# EAGLE board stm32-d40-platform (EAGLE 6.5.0)
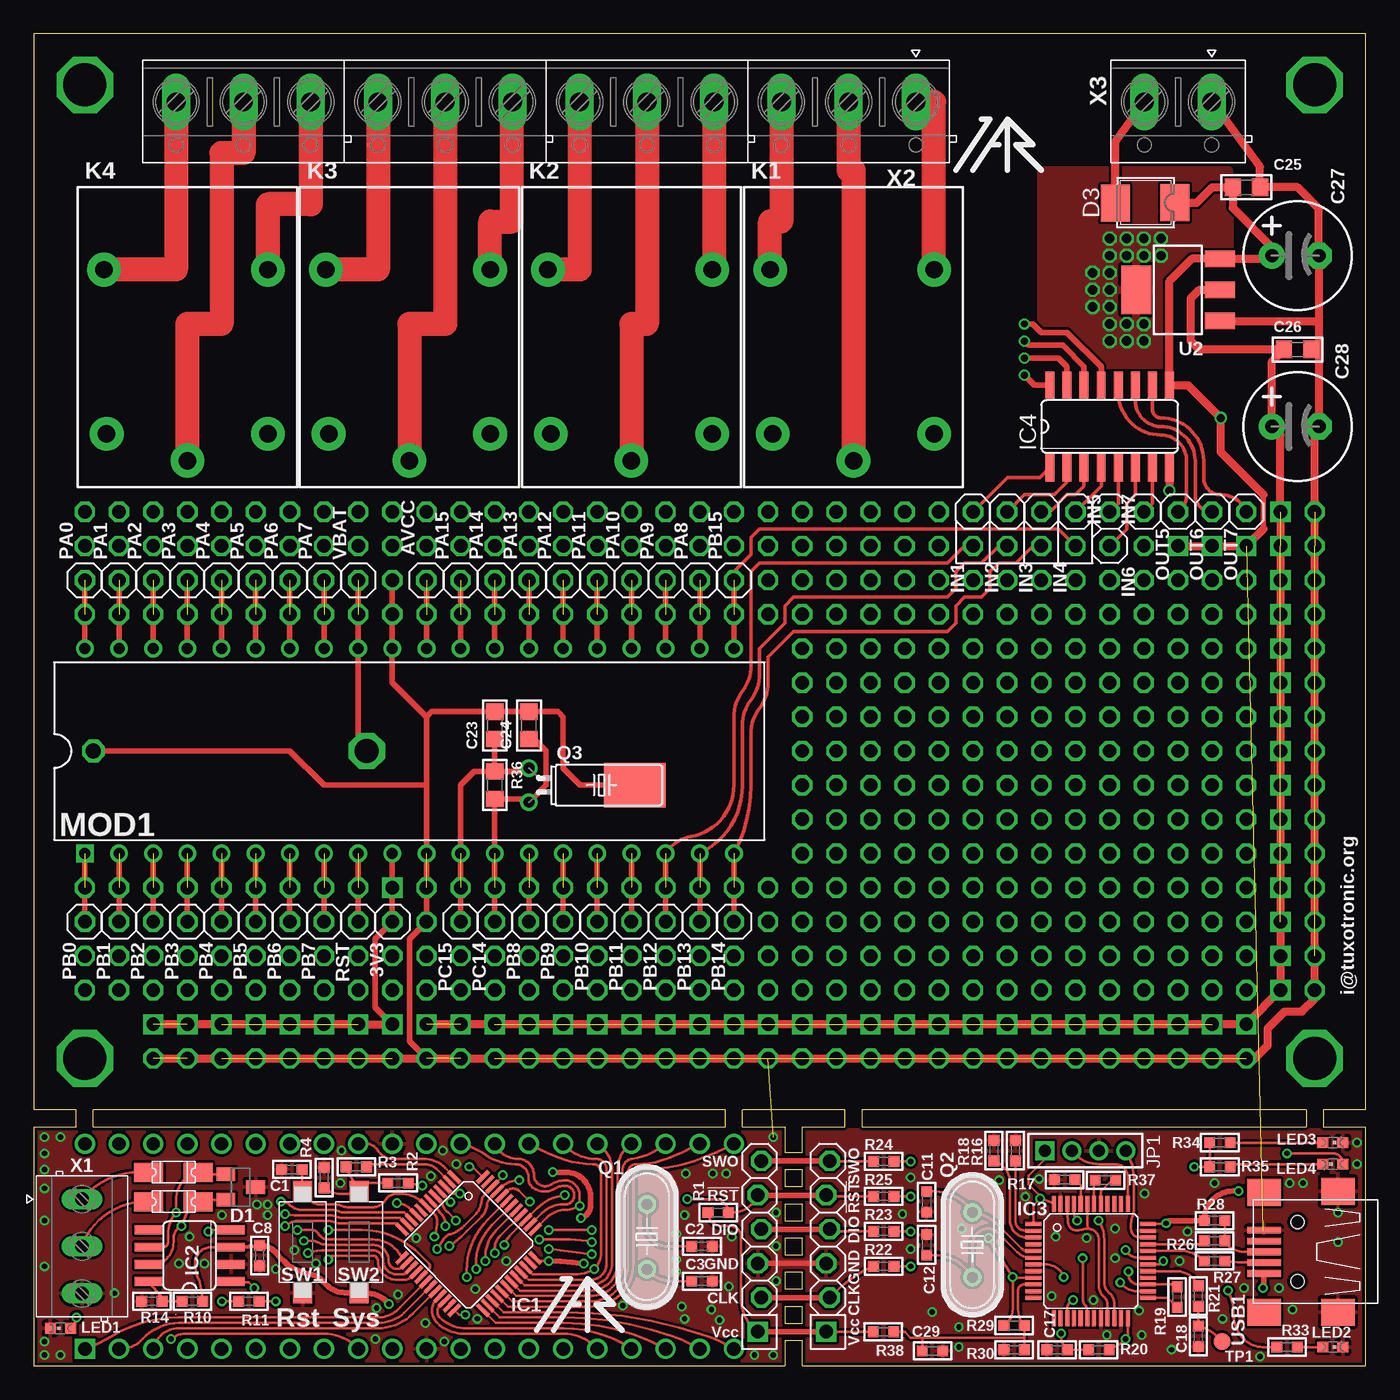
[diagram p3: board, top side]
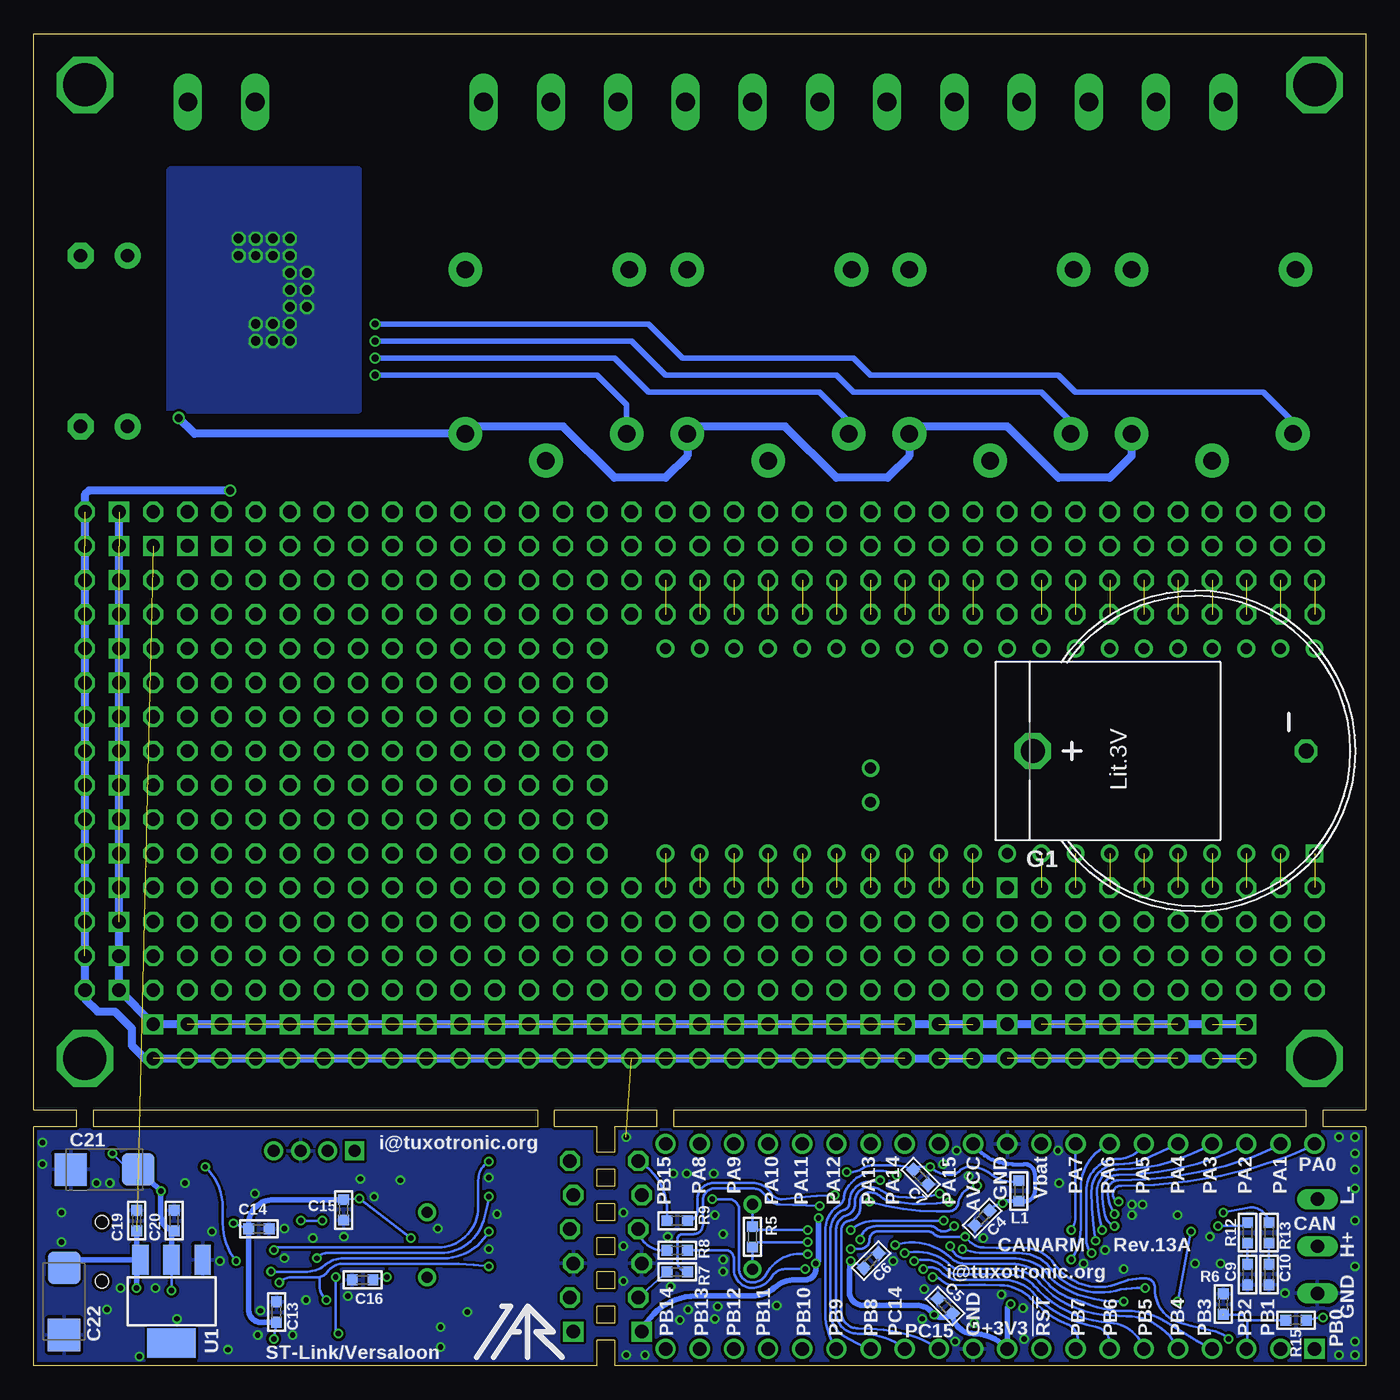
[diagram p4: board, bottom side, seen from below]

Size 99.06 x 99.06 mm. Coordinates in mm from the lower left corner, seen from the top.
Outline: 0,0 55.88,0 55.88,1.91 57.15,1.91 57.15,0 99.06,0 99.06,17.78 95.89,17.78 95.89,19.05 99.06,19.05 99.06,99.06 0,99.06 0,19.05 3.17,19.05 3.17,17.78 0,17.78 0,0
Outline: 4.45,17.78 51.44,17.78 51.44,19.05 4.45,19.05 4.45,17.78
Outline: 52.7,17.78 55.88,17.78 55.88,15.88 57.15,15.88 57.15,17.78 60.33,17.78 60.33,19.05 52.7,19.05 52.7,17.78
Outline: 55.88,14.61 55.88,13.34 57.15,13.34 57.15,14.61 55.88,14.61
Outline: 55.88,12.06 55.88,10.79 57.15,10.79 57.15,12.06 55.88,12.06
Outline: 55.88,9.53 55.88,8.26 57.15,8.26 57.15,9.53 55.88,9.53
Outline: 55.88,6.99 55.88,5.71 57.15,5.71 57.15,6.99 55.88,6.99
Outline: 55.88,4.45 55.88,3.17 57.15,3.17 57.15,4.45 55.88,4.45
Outline: 61.59,17.78 94.61,17.78 94.61,19.05 61.59,19.05 61.59,17.78
Copper layers (1*16): Top 0.035mm / dielectric 1.5mm / Bottom 0.035mm
Design rules "ITEADstudio_DRC": minimum track width 6mil, minimum drill 12mil, track to track 6mil, track to pad 6mil, pad to pad 6mil, via to via 6mil, smd to smd 0mil, copper to edge 10mil, drill to drill 10mil, minimum pad ring 10mil, minimum via ring 6mil, stop-mask expansion 2mil, vias tented up to drill 100mil, thermal gap 10mil

## Footprints (pad centres in the part's own frame; a part is rotated, then mirrored left to right if it is on the bottom)
1X01 = drill 1 octagon: 1 0,0
C0603 = smd 0.8 x 0.8: 1 -0.762,0; 2 0.762,0
SMC_C = smd 2.4 x 2.4: + -2.5,0; - 2.5,0
C0805 = smd 1.2 x 1.3: 1 -1.016,0; 2 1.016,0
CE-035X080 = drill 1 pad 1.93: + -1.905,0 | drill 1 pad 1.93 octagon: - 1.587,0
SOT23 = smd 1 x 1.4: 1 -0.95,-1.1; 2 0.95,-1.1; 3 0,1.1
SMB = smd 2.159 x 2.743: A 2.108,-0.102; C -2.311,-0.127
1206L = smd 2.16 x 1.4: P$1 -1.85,0; P$2 1.85,0
B2430 = drill 1.803 octagon: + 0,12.065 | drill 1.118 octagon: - 0,-8.255
LQFP48 = smd 0.3 x 1.2: 1 -2.75,-4.25; 2 -2.25,-4.25; 3 -1.75,-4.25; 4 -1.25,-4.25; 5 -0.75,-4.25; 6 -0.25,-4.25; 7 0.25,-4.25; 8 0.75,-4.25; 9 1.25,-4.25; 10 1.75,-4.25; 11 2.25,-4.25; 12 2.75,-4.25; 25 2.75,4.25; 26 2.25,4.25; 27 1.75,4.25; 28 1.25,4.25; 29 0.75,4.25; 30 0.25,4.25; 31 -0.25,4.25; 32 -0.75,4.25; 33 -1.25,4.25; 34 -1.75,4.25; 35 -2.25,4.25; 36 -2.75,4.25 | smd 1.2 x 0.3: 13 4.25,-2.75; 14 4.25,-2.25; 15 4.25,-1.75; 16 4.25,-1.25; 17 4.25,-0.75; 18 4.25,-0.25; 19 4.25,0.25; 20 4.25,0.75; 21 4.25,1.25; 22 4.25,1.75; 23 4.25,2.25; 24 4.25,2.75; 37 -4.25,2.75; 38 -4.25,2.25; 39 -4.25,1.75; 40 -4.25,1.25; 41 -4.25,0.75; 42 -4.25,0.25; 43 -4.25,-0.25; 44 -4.25,-0.75; 45 -4.25,-1.25; 46 -4.25,-1.75; 47 -4.25,-2.25; 48 -4.25,-2.75
SO08 = smd 0.66 x 2.032: 1 -1.905,-3.073; 2 -0.635,-3.073; 3 0.635,-3.073; 4 1.905,-3.073; 5 1.905,3.073; 6 0.635,3.073; 7 -0.635,3.073; 8 -1.905,3.073
SO16 = smd 0.66 x 2.032: 1 -4.445,-3.073; 2 -3.175,-3.073; 3 -1.905,-3.073; 4 -0.635,-3.073; 5 0.635,-3.073; 6 1.905,-3.073; 7 3.175,-3.073; 8 4.445,-3.073; 9 4.445,3.073; 10 3.175,3.073; 11 1.905,3.073; 12 0.635,3.073; 13 -0.635,3.073; 14 -1.905,3.073; 15 -3.175,3.073; 16 -4.445,3.073
DIP-40 = drill 1 square: 1 -24.13,-7.62 | drill 1: 2 -21.59,-7.62; 3 -19.05,-7.62; 4 -16.51,-7.62; 5 -13.97,-7.62; 6 -11.43,-7.62; 7 -8.89,-7.62; 8 -6.35,-7.62; 9 -3.81,-7.62; 10 -1.27,-7.62; 11 1.27,-7.62; 12 3.81,-7.62; 13 6.35,-7.62; 14 8.89,-7.62; 15 11.43,-7.62; 16 13.97,-7.62; 17 16.51,-7.62; 18 19.05,-7.62; 19 21.59,-7.62; 20 24.13,-7.62; 21 24.13,7.62; 22 21.59,7.62; 23 19.05,7.62; 24 16.51,7.62; 25 13.97,7.62; 26 11.43,7.62; 27 8.89,7.62; 28 6.35,7.62; 29 3.81,7.62; 30 1.27,7.62; 31 -1.27,7.62; 32 -3.81,7.62; 33 -6.35,7.62; 34 -8.89,7.62; 35 -11.43,7.62; 36 -13.97,7.62; 37 -16.51,7.62; 38 -19.05,7.62; 39 -21.59,7.62; 40 -24.13,7.62
1X04M = drill 0.9 square: 1 -3,0 | drill 0.9: 2 -1,0; 3 1,0; 4 3,0
ZN5 = drill 1.3 pad 2.5: 11 8.89,0; 12 -5.31,-6.2; 14 -5.31,6; A1 6.89,6; A2 6.89,-6
L0603 = smd 0.8 x 0.8: 1 -0.762,0; 2 0.762,0
CHIPLED_0603 = smd 0.8 x 0.8: A 0,-0.75; C 0,0.75
DIL40 = drill 0.813 square: 1 -24.13,-7.62 | drill 0.813: 2 -21.59,-7.62; 3 -19.05,-7.62; 4 -16.51,-7.62; 5 -13.97,-7.62; 6 -11.43,-7.62; 7 -8.89,-7.62; 8 -6.35,-7.62; 9 -3.81,-7.62; 10 -1.27,-7.62; 11 1.27,-7.62; 12 3.81,-7.62; 13 6.35,-7.62; 14 8.89,-7.62; 15 11.43,-7.62; 16 13.97,-7.62; 17 16.51,-7.62; 18 19.05,-7.62; 19 21.59,-7.62; 20 24.13,-7.62; 21 24.13,7.62; 22 21.59,7.62; 23 19.05,7.62; 24 16.51,7.62; 25 13.97,7.62; 26 11.43,7.62; 27 8.89,7.62; 28 6.35,7.62; 29 3.81,7.62; 30 1.27,7.62; 31 -1.27,7.62; 32 -3.81,7.62; 33 -6.35,7.62; 34 -8.89,7.62; 35 -11.43,7.62; 36 -13.97,7.62; 37 -16.51,7.62; 38 -19.05,7.62; 39 -21.59,7.62; 40 -24.13,7.62
HC49/S = drill 0.813: 1 -2.413,0; 2 2.413,0
TC38H-G = drill 0.8: 1 -1.27,0; 2 1.27,0 | smd 3.302 x 4.572: GND 0,7.874
R0603 = smd 0.8 x 0.8: 1 -0.762,0; 2 0.762,0
R0805 = smd 1.2 x 1.3: 1 -1.016,0; 2 1.016,0
KSS-2EG4430 = smd 1.6 x 1.4: 1 -3.75,0; 2 3.75,0
JTAG6PIN = drill 1 square: 1 -6.35,0.127 | drill 1 octagon: 2 -3.81,-0.127; 3 -1.27,0.127; 4 1.27,-0.127; 5 3.81,0.127; 6 6.35,-0.127
SWD6PIN_L = drill 1 square: 1 -6.35,0.127 | drill 1 octagon: 2 -3.81,-0.127; 3 -1.27,0.127; 4 1.27,-0.127; 5 3.81,0.127; 6 6.35,-0.127
B1,27 = smd 1.27 x 1.27: PP 0,0
SOT223 = smd 1.219 x 2.235: 1 -2.311,-3.099; 2 0,-3.099; 3 2.311,-3.099 | smd 3.6 x 2.2: 4 0,3.099
USB-MB-S2 = smd 2.5 x 0.5: D+ 2.5,0; D- 2.5,0.8; GND 2.5,-1.6; ID 2.5,-0.8; VBUS 2.5,1.6 | smd 2.5 x 2: GND@1 -3,4.5; GND@2 2.5,4.5; GND@3 -3,-4.5; GND@4 2.5,-4.4 | hole 1: 0,2.2; 0,-2.2
DG350-3.5-03P = drill 1 long: 1 -3.5,0; 2 0,0; 3 3.5,0
DG306-5.0-12P = drill 1.4 long: 1 -27.5,0; 2 -22.5,0; 3 -17.5,0; 4 -12.5,0; 5 -7.5,0; 6 -2.5,0; 7 2.5,0; 8 7.5,0; 9 12.5,0; 10 17.5,0; 11 22.5,0; 12 27.5,0
DG306-5.0-02P = drill 1.4 long: 1 -2.5,0; 2 2.5,0

## Placement (x,y rotation side)
3V3  [1X01]  26.67,33.02 270 top
AVCC  [1X01]  29.21,58.42 90 top
C1  0.1  [C0603]  19.2,14.6 180 top
C2  22pF  [C0603]  49.7,8.9 0 top
C3  22pF  [C0603]  49.7,6.3 0 top
C4  0.1  [C0603]  28.53,10.99 225 bottom
C5  0.1  [C0603]  31.27,4.45 135 bottom
C6  0.1  [C0603]  36.78,7.82 45 bottom
C7  0.1  [C0603]  33.11,14.04 315 bottom
C8  0.1  [C0603]  16.8,8.2 270 top
C9  560pF  [C0603]  8.8,6.8 270 bottom
C10  560pF  [C0603]  7.2,6.8 270 bottom
C11  20pF  [C0603]  66.4,12.2 270 top
C12  20pF  [C0603]  66.4,9 90 top
C13  0.1  [C0603]  81,4 90 bottom
C14  0.1  [C0603]  82.3,10.2 0 bottom
C15  0.1  [C0603]  76,11.6 270 bottom
C16  0.1  [C0603]  74.6,6.4 180 bottom
C17  0.1  [C0603]  76.1,1.2 180 top
C18  20pF  [C0603]  86.6,2.2 270 top
C19  0.1  [C0603]  91.4,10.8 90 bottom
C20  0.1  [C0603]  88.6,10.8 90 bottom
C21  100uF/6V3  [SMC_C]  93.8,14.6 180 bottom
C22  100uF/6V3  [SMC_C]  96.8,4.8 270 bottom
C23  22pF  [C0805]  34.29,47.62 90 top
C24  22pF  [C0805]  36.83,47.62 90 top
C25  0.1  [C0805]  90.17,87.63 0 top
C26  0.1  [C0805]  93.98,75.56 0 top
C27  100uF/6V3  [CE-035X080]  93.98,82.55 0 top
C28  100uF/6V3  [CE-035X080]  93.98,69.85 0 top
C29  0.01  [C0603]  66.83,1.11 0 top
D1  PESD1CAN  [SOT23]  15.4,13.3 270 top
D3  [SMB]  82.55,86.36 180 top
F1  0.2A  [1206L]  10.4,12.2 180 top
F2  0.2A  [1206L]  10.4,14.4 180 top
G1  B2430  [B2430]  12.7,45.72 90 bottom
IC1  STM32F103C8  [LQFP48]  32.34,9.09 225 top
IC2  TODO AMIS30663CANG2G  [SO08]  11.6,8.2 90 top
IC3  STM32F103C8  [LQFP48]  78.6,7.8 270 top
IC4  [SO16]  80.01,69.85 0 top
IN1  [1X01]  69.85,63.5 270 top
IN2  [1X01]  72.39,63.5 270 top
IN3  [1X01]  74.93,63.5 270 top
IN4  [1X01]  77.47,63.5 270 top
IN5  [1X01]  80.01,63.5 270 top
IN6  [1X01]  80.01,60.96 270 top
IN7  [1X01]  82.55,63.5 270 top
J1  DIP-40  [DIP-40]  27.94,8.89 0 top
JP1  [1X04M]  78.2,16 0 top
K1  ZNS5124  [ZN5]  60.96,76.2 270 top
K2  ZNS5124  [ZN5]  44.45,76.2 270 top
K3  ZNS5124  [ZN5]  27.94,76.2 270 top
K4  ZNS5124  [ZN5]  11.43,76.2 270 top
L1  bead  [L0603]  25.8,13.01 270 bottom
LED1  [CHIPLED_0603]  2,2.8 90 top
LED2  Red  [CHIPLED_0603]  96.6,1.4 270 top
LED3  Red  [CHIPLED_0603]  96.6,16.6 270 top
LED4  Green  [CHIPLED_0603]  96.6,15 90 top
MOD1  STM32-MOD-CAN  [DIL40]  27.94,45.72 0 top
OUT5  [1X01]  85.09,63.5 270 top
OUT6  [1X01]  87.63,63.5 270 top
OUT7  [1X01]  90.17,63.5 270 top
PA0  [1X01]  3.81,58.42 90 top
PA1  [1X01]  6.35,58.42 90 top
PA2  [1X01]  8.89,58.42 90 top
PA3  [1X01]  11.43,58.42 90 top
PA4  [1X01]  13.97,58.42 90 top
PA5  [1X01]  16.51,58.42 90 top
PA6  [1X01]  19.05,58.42 90 top
PA7  [1X01]  21.59,58.42 90 top
PA8  [1X01]  49.53,58.42 90 top
PA9  [1X01]  46.99,58.42 90 top
PA10  [1X01]  44.45,58.42 90 top
PA11  [1X01]  41.91,58.42 90 top
PA12  [1X01]  39.37,58.42 90 top
PA13  [1X01]  36.83,58.42 90 top
PA14  [1X01]  34.29,58.42 90 top
PA15  [1X01]  31.75,58.42 90 top
PB0  [1X01]  3.81,33.02 270 top
PB1  [1X01]  6.35,33.02 270 top
PB2  [1X01]  8.89,33.02 270 top
PB3  [1X01]  11.43,33.02 270 top
PB4  [1X01]  13.97,33.02 270 top
PB5  [1X01]  16.51,33.02 270 top
PB6  [1X01]  19.05,33.02 270 top
PB7  [1X01]  21.59,33.02 270 top
PB8  [1X01]  36.83,33.02 270 top
PB9  [1X01]  39.37,33.02 270 top
PB10  [1X01]  41.91,33.02 270 top
PB11  [1X01]  44.45,33.02 270 top
PB12  [1X01]  46.99,33.02 270 top
PB13  [1X01]  49.53,33.02 270 top
PB14  [1X01]  52.07,33.02 270 top
PB15  [1X01]  52.07,58.42 90 top
PC14  [1X01]  34.29,33.02 270 top
PC15  [1X01]  31.75,33.02 270 top
Q1  8MHz  [HC49/S]  45.6,9.6 270 top
Q2  8MHz  [HC49/S]  69.8,9 270 top
Q3  32768Hz  [TC38H-G]  36.83,43.18 270 top
R1  10K  [R0603]  50.9,11.4 180 top
R2  10K  [R0603]  27.1,13.6 0 top
R3  10K  [R0603]  24,14.8 0 top
R4  2.2K  [R0603]  21.6,14 270 top
R5  1M  [R0603]  45.6,9.6 270 bottom
R6  10K  [R0603]  10.6,4.6 90 bottom
R7  100  [R0603]  51.2,7 180 bottom
R8  100  [R0603]  51.2,8.6 180 bottom
R9  100  [R0603]  51.2,10.8 180 bottom
R10  0  [R0603]  11.8,4.8 180 top
R11  100  [R0603]  16,4.8 180 top
R12  100  [R0603]  8.8,9.9 90 bottom
R13  100  [R0603]  7.2,9.9 90 bottom
R14  NC  [R0603]  8.8,4.8 0 top
R15  330  [R0603]  5.2,3.4 0 bottom
R16  10K  [R0603]  73,16 270 top
R17  100K  [R0603]  76.66,13.85 0 top
R18  10K  [R0603]  71.4,16 270 top
R19  220  [R0603]  85.02,5.12 270 top
R20  100K  [R0603]  79.2,1.2 0 top
R21  100  [R0603]  86.6,5.2 270 top
R22  22  [R0603]  63.2,7.4 180 top
R23  22  [R0603]  63.2,10 180 top
R24  22  [R0603]  63.2,15.2 180 top
R25  22  [R0603]  63.2,12.6 180 top
R26  22  [R0603]  87.8,9.3 0 top
R27  22  [R0603]  87.8,7.8 0 top
R28  1.5K  [R0603]  87.8,10.8 180 top
R29  4.7K  [R0603]  72.9,3 180 top
R30  4.7K  [R0603]  72.9,1.2 0 top
R33  1K  [R0603]  93.2,1.4 0 top
R34  510  [R0603]  88.2,16.6 0 top
R35  510  [R0603]  88.2,14.8 0 top
R36  1M  [R0805]  34.29,43.18 270 top
R37  220  [R0603]  79.69,13.81 180 top
R38  4.7K  [R0603]  63.18,2.54 180 top
RST  [1X01]  24.13,33.02 270 top
S3.LOGO  LOGO  [TT_LOGO]  62.33,3.17 0 bottom
SW1  KSS-2EG4430  [KSS-2EG4430]  20,9.2 90 top
SW2  KSS-2EG4430  [KSS-2EG4430]  24.2,9.2 90 top
SWD1  SWD-6  [JTAG6PIN]  53.98,8.89 90 top
SWD2  SWD-6L  [SWD6PIN_L]  59.05,8.89 90 top
TP1  TPB1,27  [B1,27]  88.36,1.82 270 top
U1  [SOT223]  88.8,4.8 180 bottom
U2  [SOT223]  85.09,80.01 90 top
U$  LOGO  [TT_LOGO]  41.2,5.2 0 top
U$1  LOGO  [TT_LOGO]  72.39,91.44 0 top
USB1  USB-MB-S2  [USB-MB-S2]  93.98,8.49 180 top
VBAT  [1X01]  24.13,58.42 90 top
X1  DG3XX-03-3.5  [DG350-3.5-03P]  3.6,8.89 270 top
X2  DG3XX-12-5.0  [DG306-5.0-12P]  38.1,93.98 180 top
X3  DG3XX-02-5.0  [DG306-5.0-02P]  85.09,93.98 180 top

## Tracks (layer width: path | path; a pad name or v marks a point on that pad's centre or on a via)
!RESET  (via drill 0.4)
  Top 0.2: C1.1 SW1.2 arc68 21.4,12 22.4,12 arc-23 22.9,11.9 arc23 23.4,11.8 25.2,11.8 arc62 26.2,12.4 arc-53 27,12.8 27.28,12.8 arc-50 IC1.7 29.8,11.28 arc-46 30,10.8 arc-19 v29.8,9.6 | v38.3,8.7 v41.5,8.3 | v10.2,2 arc-37 11.4,2.4 21.6,2.4 arc-48 J1.9 | v48.6,12.4 50.66,12.4 arc-90 R1.1 51.95,11.4 arc69 SWD1.5 | R25.2 59.03,12.6 SWD2.5
  Top 0.406: SWD1.5 SWD2.5
  Bottom 0.2: v38.3,8.7 37.6,8.7 arc-90 36.9,9.4 arc90 36.3,10 32.6,10 arc44 32.1,9.8 arc-44 31.6,9.6 v29.8,9.6 29.4,9.2 arc-41 28.4,8.8 arc-2 25.6,8.8 arc56 23.2,7.6 arc-77 18.2,6.2 arc26 16.5,6.5 arc-6 16.4,6.5 arc96 15.7,5.8 15.7,5.7 arc-74 13.8,3.2 arc-3 11.4,2.6 arc32 v10.2,2 | v41.5,8.3 arc-72 44.6,6.8 arc62 45.6,6.2 arc90 46.6,7.2 46.6,11.6 arc-90 47.4,12.4 v48.6,12.4
!S2.RESET  (via drill 1)  (1 unrouted)
  Top 0.406: MOD1.9 RST.1
  other vias: 24.13,35.56
!S3.RESET  (via drill 0.4)
  Top 0.2: R20.1 C17.1 arc-51 76.4,2.16 v76.4,2.4 | IC3.7 75.25,7.55 arc-70 v76.6,6.6
  Bottom 0.2: v76.6,6.6 76.6,2.6 v76.4,2.4
+3V3  (via drill 0.4)
  Top 0.2: IC1.24 31.62,3.8 v32.1,3.8 | IC1.48 32.7,14.74 v32.4,14.8 | v38.3,7.8 37.52,7.8 IC1.36 | IC2.3 13.23,8.84 arc90 12,7.6 arc23 12.2,6.6 arc-22 R10.1 | SWD1.1 arc-54 52.6,4.99 52.6,9.6 arc90 51.8,10.4 51.14,10.4 arc-90 R1.2 | SWD2.1 R38.2
  Top 0.3: IC2.3 arc7 C8.1
  Top 0.406: v38.3,7.8 arc-9 v40.9,7.6 | v38.6,14.4 39.6,14.4 arc-90 41.4,12.6 41.4,11.9 arc-76 v40.7,11 | C8.1 arc-56 18.1,8.3 arc41 20.6,6.8 arc-41 21.6,6.2 arc52 23.15,5.45 SW2.1 24.25,5.4 24.8,5.4 arc-53 v26.4,4.6 | SWD1.1 SWD2.1
  Bottom 0.2: C6.1 38.24,7.8 v38.3,7.8 | C5.1 30.84,3.8 | v38.6,14.4 38.4,14.4 arc-33 37.4,14.7 arc30 36.8,14.9 arc7 34.9,14.9 arc22 C7.1 33.42,14.8 v32.4,14.8 arc-44 30.9,14.2 arc-46 30.2,14.5 arc46 29.5,14.8 arc39 27.8,14.2 arc-54 L1.1
  Bottom 0.4: 30.84,3.8 arc71 v32.1,3.8
  Bottom 0.406: v38.3,7.8 arc-10 38.4,6.7 38.4,5.5 arc-90 37.4,4.5 33.4,4.5 arc57 v32.1,3.8 | v40.7,11 40.7,7.8 v40.9,7.6 arc15 40.9,7.1 arc82 41.7,6.4 42.4,6.4 arc-41 44,5.8 arc41 45.6,5.2 49.79,5.2 arc-66 SWD1.1 | C5.1 arc-89 29.2,2.4 arc48 J1.10 26.67,4.33 v26.4,4.6
+5V  (via drill 0.4, 0.6, 1)  (1 unrouted)
  Top 0.406: USB1.VBUS 91.48,5.88 v91.4,5.8 | 91.44,62.23 91.44,64.77
  Top 0.61: D3.C 86.49,86.49 87.63,87.63 C25.1 89.15,86.11 92.08,83.19 C27.+ 91.85,82.32 U2.3 86.13,82.32 84.45,80.64 IC4.9 85.83,72.92 v88.27,70.48 88.27,67.94 91.44,64.77 | v85.09,60.96 v87.63,60.96 v90.17,60.96 91.44,62.23
  Bottom 0.406: C19.1 91.4,8.19 U1.3 | U1.3 96.2,7.9 C22.+ | v91.4,5.8 91.4,7.61 U1.3
  Bottom 0.61: K4.A1 17.43,67.66 19.05,66.04 22.86,66.04 26.67,69.85 33.4,69.85 K3.A1 33.94,67.66 35.56,66.04 39.37,66.04 43.18,69.85 49.91,69.85 K2.A1 50.45,67.66 52.07,66.04 55.88,66.04 59.69,69.85 66.42,69.85 K1.A1 87.09,69.31 v88.27,70.48
AVCC  (via drill 0.4)
  Top 0.2: IC1.9 27.96,11.7 arc45 v27,12.1
  Bottom 0.2: C4.1 27.82,11.7 arc38 v27,12.1
  Bottom 0.3: v27,12.1 26.85,12.25 L1.2 25.35,12.25 arc-90 24.6,13 24.6,14.2 arc-90 25.4,15 26.3,15 arc55 J1.30
BOOT0  (via drill 0.4)
  Top 0.2: v28.9,13.4 R2.2 | v36.9,12.2 36.1,13 arc90 35.19,13 IC1.44
  Bottom 0.2: v28.9,13.4 arc-69 30.3,12.2 arc90 31,11.5 31.9,11.5 arc16 v36.9,12.2
CAN_CTRL
  Top 0.2: IC2.8 9.56,5.06 R14.2 R10.2
CAN_H
  Top 0.2: F1.P$2 8.31,12.2 arc70 X1.2
CAN_L
  Top 0.2: F2.P$2 7.8,14.4 arc51 X1.1
GND  (via drill 0.4, 0.6, 1)  (44 unrouted)
  Top 0.406: SWD2.3 SWD1.3 | 29.21,43.18 MOD1.11 v29.21,33.02 27.94,31.75 27.94,24.13 v29.21,22.86 | 43.18,43.18 Q3.GND 40.64,43.18 39.37,44.45 39.37,48.26 38.99,48.64 C24.2 C23.2 29.59,48.64 29.21,48.26 | 29.21,43.18 21.59,43.18 19.05,45.72 G1.- | 29.21,48.26 26.67,50.8 MOD1.31 v26.67,55.88 v26.67,58.42 | 29.21,43.18 29.21,48.26
  Top 0.61: v8.89,22.86 v26.67,22.86 v29.21,22.86 v90.17,22.86 90.81,22.86 91.76,23.81 91.76,25.08 93.03,26.35 94.3,26.35 95.25,27.3 v95.25,27.94 v95.25,63.5 95.25,69.53 C28.- 95.57,75.56 | 95.57,77.47 C27.- 95.57,86.04 93.98,87.63 C25.2 91.19,89.15 87.63,93.98 X3.1 | 95.57,77.47 95.57,75.56 | U2.1 95.34,77.7 95.57,77.47 | C26.2 95.57,75.56 | IC4.8 v84.45,65.09
  Bottom 0.61: v8.89,22.86 v90.17,22.86 90.81,22.86 91.76,23.81 91.76,25.08 93.03,26.35 94.3,26.35 95.25,27.3 v95.25,27.94 v95.25,63.5 95.25,64.77 94.93,65.09 v84.45,65.09
  other vias: 28.44,9.5 32.84,5.7 35.14,7.8 22.8,13.6 30.44,16 12.7,7.6 48.5,14.3 48.4,11.2 51.7,5.9 43.8,4.5 17.4,12 17.4,11.2 16.6,12 11.6,9.6 6,5.4 29.14,3.2 30.54,1.8 48.2,4.4 48.4,3.5 50.4,4.2 47.8,7 47.8,7.9 47.8,9.8 50.5,14.3 51.5,14.3 31.44,15 29.54,14.1 22.9,16 19.4,8.6 18,7.2 33,3.5 25.5,4.3 27.1,5.3 25.4,2 51.9,9.6 55.2,11.4 55.2,8.9 55.2,6.3 53.6,0.8 51,3.4 0.8,0.8 2,0.8 0.8,17 2,17 0.8,15.8 21,7.6 55,0.8 55,17 14,11.2 10.8,7.6 0.8,14.6 0.8,13.2 0.8,10.8 0.8,7.4 0.8,1.8 76,9.6 80.4,10.2 88.4,3.5 75.7,5.2 82.2,4.1 79.8,2.3 84.6,1.2 93.6,4.2 92.6,5.8 90,5.8 73.74,12.57 82.6,12.8 98.4,16.6 87.8,13.6 93.4,13.6 97,11.4 97,9.2 91.2,0.7 78.3,9.5 80.4,8 85.2,7.8 78.8,4.9 69,10.2 82.4,2.3 68.8,1.4 68.8,2.9 66.8,4 65.2,8.7 64.6,11.3 65.2,14 74.76,13.91 71.8,13.8 85.8,10 98.4,15 94.4,13.6 11.43,22.86 13.97,22.86 16.51,22.86 19.05,22.86 21.59,22.86 24.13,22.86 31.75,22.86 34.29,22.86 36.83,22.86 39.37,22.86 41.91,22.86 44.45,22.86 46.99,22.86 49.53,22.86 52.07,22.86 54.61,22.86 57.15,22.86 59.69,22.86 62.23,22.86 64.77,22.86 67.31,22.86 69.85,22.86 72.39,22.86 74.93,22.86 77.47,22.86 80.01,22.86 82.55,22.86 85.09,22.86 87.63,22.86 95.25,30.48 95.25,33.02 95.25,35.56 95.25,38.1 95.25,40.64 95.25,43.18 95.25,45.72 95.25,48.26 95.25,50.8 95.25,53.34 95.25,55.88 95.25,58.42 95.25,60.96 29.21,35.56
  pour Top (isolate 0.203): -0.64,17.58 99.69,17.58 99.69,-0.64 -0.64,-0.64
  pour Bottom (isolate 0.203): -1.27,17.58 100.33,17.58 100.33,-1.27 -1.27,-1.27
HEAT  (via drill 0.7)
  other vias: 80.01,80.01 80.01,78.74 81.28,77.47 82.55,77.47 80.01,81.28 81.28,83.82 80.01,83.82 81.28,82.55 82.55,82.55 80.01,82.55 83.82,83.82 83.82,82.55 82.55,83.82 80.01,77.47 82.55,76.2 81.28,76.2 80.01,76.2 78.74,81.28 78.74,80.01 78.74,78.74
  pour Top (isolate 0.203): 88.9,88.9 88.9,71.12 74.93,71.12 74.93,88.9
  pour Bottom (isolate 0.203): 88.9,88.9 88.9,71.12 74.93,71.12 74.93,88.9
MCO
  Top 0.2: TP1.PP 88.02,2.16 arc31 C18.1 R21.2
N$1
  Top 0.2: R3.1 23.24,14.71 SW2.2 | R2.1 24.65,13.6 SW2.2 | SW2.2 24.45,12.8 22.8,12.8 arc-40 R4.2
N$2
  Top 0.2: IC3.44 77.85,13.42 R17.2
N$3
  Top 0.2: IC3.3 73.85,9.55 arc-90 72.6,10.8 72.6,13.6 arc72 R18.2
N$4
  Top 0.2: IC3.2 73.75,10.05 arc-90 73,10.8 R16.2
N$5  (via drill 0.4)
  Top 0.2: v3.2,3.6 3,3.05 LED1.A
  Bottom 0.2: R15.2 3.4,3.6 v3.2,3.6
N$6  (via drill 1)
  other vias: 26.67,27.94
N$7  (via drill 0.4)
  Top 0.2: R11.2 v14,4.8 | v13,10 13.11,10.11 IC2.4
  Bottom 0.2: v14,4.8 v13,10
N$8  (via drill 1)
  other vias: 8.89,27.94
N$9  (via drill 1)
  other vias: 8.89,30.48
N$10  (via drill 1)
  other vias: 26.67,30.48
N$11
  Top 0.61: D3.A 80.44,91.05 X3.2
N$12  (via drill 1)
  other vias: 87.63,27.94
N$13  (via drill 1)
  other vias: 90.17,27.94
N$14  (via drill 1)
  other vias: 87.63,30.48
N$15  (via drill 1)
  other vias: 90.17,30.48
N$45
  Top 0.2: IC3.29 84.91,7.05 arc-66 R21.1
N$46  (via drill 3.2)
  other vias: 3.81,22.86
N$47
  Top 0.2: USB1.D+ 89.94,8.49 arc-61 R26.2 R28.1
N$48
  Top 0.2: USB1.D- 90.02,7.69 arc-9 R27.2
N$50
  Top 0.2: R33.2 LED2.A
N$51  (via drill 0.4)
  Top 0.2: D1.2 12.4,12.35 F1.P$1 11.7,12.2 v11,10.4 arc67 10.4,9.4 10.4,9.2 arc-65 9.37,7.57 IC2.7
  Bottom 0.2: v11,10.4 8.94,10.4 R12.2
N$52  (via drill 0.4)
  Top 0.2: D1.1 12.4,14.25 F2.P$1 | IC2.6 9.63,8.84 arc90 10,9.2 10,9.8 arc-41 v10.6,11.4 10.6,12.4 arc-79 F2.P$1 | 12,14.4 F2.P$1
  Bottom 0.2: v10.6,11.4 8.6,11.8 arc78 R13.2
N$53
  Top 0.2: LED4.C 89.16,15 R35.2
N$54
  Bottom 0.2: C10.1 R13.1
N$55
  Bottom 0.2: C9.1 R12.1
N$56
  Top 0.2: R34.2 LED3.A
N$57  (via drill 3.2)
  other vias: 95.25,22.86
N$58  (via drill 3.2)
  other vias: 3.81,95.25
N$59  (via drill 3.2)
  other vias: 95.25,95.25
N$60  (via drill 1)
  other vias: 6.35,27.94
N$61  (via drill 1)
  other vias: 6.35,30.48
N$62  (via drill 1)
  other vias: 3.81,27.94
N$63  (via drill 1)
  other vias: 3.81,30.48
N$64
  Top 1.778: K1.14 66.96,93.98 X2.1
N$65
  Top 1.778: X2.2 60.6,88.9 60.96,88.9 K1.11
N$66
  Top 1.778: X2.3 55.6,85.09 54.76,85.09 K1.12
N$67
  Top 1.778: X2.4 50.6,81.51 K2.14
N$68
  Top 1.778: X2.5 45.6,77.47 44.45,77.47 K2.11
N$69
  Top 1.778: X2.6 40.6,81.51 K2.12
N$70
  Top 1.778: K3.14 33.94,85.09 35.56,85.09 35.56,93.98 X2.7
N$71
  Top 1.778: X2.8 30.6,77.47 27.94,77.47 K3.11
N$72
  Top 1.778: X2.9 25.6,81.51 K3.12
N$73
  Top 1.778: X2.10 20.6,86.36 17.43,86.36 K4.14
N$74
  Top 1.778: X2.11 15.6,90.17 13.97,90.17 13.97,77.47 11.43,77.47 K4.11
N$75
  Top 1.778: X2.12 10.6,81.51 K4.12
N$114  (via drill 1)
  other vias: 11.43,27.94
N$115  (via drill 1)
  other vias: 13.97,27.94
N$116  (via drill 1)
  other vias: 16.51,27.94
N$117  (via drill 1)
  other vias: 19.05,27.94
N$118  (via drill 1)
  other vias: 21.59,27.94
N$119  (via drill 1)
  other vias: 24.13,27.94
N$121  (via drill 1)
  other vias: 29.21,27.94
N$122  (via drill 1)
  other vias: 31.75,27.94
N$123  (via drill 1)
  other vias: 34.29,27.94
N$124  (via drill 1)
  other vias: 36.83,27.94
N$125  (via drill 1)
  other vias: 39.37,27.94
N$126  (via drill 1)
  other vias: 41.91,27.94
N$127  (via drill 1)
  other vias: 44.45,27.94
N$128  (via drill 1)
  other vias: 46.99,27.94
N$129  (via drill 1)
  other vias: 49.53,27.94
N$130  (via drill 1)
  other vias: 52.07,27.94
N$131  (via drill 1)
  other vias: 54.61,27.94
N$132  (via drill 1)
  other vias: 57.15,27.94
N$133  (via drill 1)
  other vias: 59.69,27.94
N$134  (via drill 1)
  other vias: 62.23,27.94
N$135  (via drill 1)
  other vias: 64.77,27.94
N$136  (via drill 1)
  other vias: 67.31,27.94
N$137  (via drill 1)
  other vias: 69.85,27.94
N$138  (via drill 1)
  other vias: 72.39,27.94
N$139  (via drill 1)
  other vias: 74.93,27.94
N$140  (via drill 1)
  other vias: 77.47,27.94
N$141  (via drill 1)
  other vias: 80.01,27.94
N$142  (via drill 1)
  other vias: 82.55,27.94
N$143  (via drill 1)
  other vias: 85.09,27.94
N$144  (via drill 1)
  other vias: 11.43,30.48
N$145  (via drill 1)
  other vias: 13.97,30.48
N$146  (via drill 1)
  other vias: 16.51,30.48
N$147  (via drill 1)
  other vias: 19.05,30.48
N$148  (via drill 1)
  other vias: 21.59,30.48
N$149  (via drill 1)
  other vias: 24.13,30.48
N$151  (via drill 1)
  other vias: 29.21,30.48
N$152  (via drill 1)
  other vias: 31.75,30.48
N$153  (via drill 1)
  other vias: 34.29,30.48
N$154  (via drill 1)
  other vias: 36.83,30.48
N$155  (via drill 1)
  other vias: 39.37,30.48
N$156  (via drill 1)
  other vias: 41.91,30.48
N$157  (via drill 1)
  other vias: 44.45,30.48
N$158  (via drill 1)
  other vias: 46.99,30.48
N$159  (via drill 1)
  other vias: 49.53,30.48
N$160  (via drill 1)
  other vias: 52.07,30.48
N$161  (via drill 1)
  other vias: 54.61,30.48
N$162  (via drill 1)
  other vias: 57.15,30.48
N$163  (via drill 1)
  other vias: 59.69,30.48
N$164  (via drill 1)
  other vias: 62.23,30.48
N$165  (via drill 1)
  other vias: 64.77,30.48
N$166  (via drill 1)
  other vias: 67.31,30.48
N$167  (via drill 1)
  other vias: 69.85,30.48
N$168  (via drill 1)
  other vias: 72.39,30.48
N$169  (via drill 1)
  other vias: 74.93,30.48
N$170  (via drill 1)
  other vias: 77.47,30.48
N$171  (via drill 1)
  other vias: 80.01,30.48
N$172  (via drill 1)
  other vias: 82.55,30.48
N$173  (via drill 1)
  other vias: 85.09,30.48
N$174  (via drill 1)
  other vias: 57.15,33.02
N$175  (via drill 1)
  other vias: 59.69,33.02
N$176  (via drill 1)
  other vias: 62.23,33.02
N$177  (via drill 1)
  other vias: 64.77,33.02
N$178  (via drill 1)
  other vias: 67.31,33.02
N$179  (via drill 1)
  other vias: 69.85,33.02
N$180  (via drill 1)
  other vias: 72.39,33.02
N$181  (via drill 1)
  other vias: 74.93,33.02
N$182  (via drill 1)
  other vias: 77.47,33.02
N$183  (via drill 1)
  other vias: 80.01,33.02
N$184  (via drill 1)
  other vias: 82.55,33.02
N$185  (via drill 1)
  other vias: 85.09,33.02
N$186  (via drill 1)
  other vias: 87.63,33.02
N$187  (via drill 1)
  other vias: 90.17,33.02
N$194  (via drill 1)
  other vias: 57.15,35.56
N$195  (via drill 1)
  other vias: 59.69,35.56
N$196  (via drill 1)
  other vias: 62.23,35.56
N$197  (via drill 1)
  other vias: 64.77,35.56
N$198  (via drill 1)
  other vias: 67.31,35.56
N$199  (via drill 1)
  other vias: 69.85,35.56
N$200  (via drill 1)
  other vias: 72.39,35.56
N$201  (via drill 1)
  other vias: 74.93,35.56
N$202  (via drill 1)
  other vias: 77.47,35.56
N$203  (via drill 1)
  other vias: 80.01,35.56
N$204  (via drill 1)
  other vias: 82.55,35.56
N$205  (via drill 1)
  other vias: 85.09,35.56
N$206  (via drill 1)
  other vias: 87.63,35.56
N$207  (via drill 1)
  other vias: 90.17,35.56
N$208  (via drill 1)
  other vias: 57.15,38.1
N$209  (via drill 1)
  other vias: 59.69,38.1
N$210  (via drill 1)
  other vias: 62.23,38.1
N$211  (via drill 1)
  other vias: 64.77,38.1
N$212  (via drill 1)
  other vias: 67.31,38.1
N$213  (via drill 1)
  other vias: 69.85,38.1
N$214  (via drill 1)
  other vias: 72.39,38.1
N$215  (via drill 1)
  other vias: 74.93,38.1
N$216  (via drill 1)
  other vias: 77.47,38.1
N$217  (via drill 1)
  other vias: 80.01,38.1
N$218  (via drill 1)
  other vias: 82.55,38.1
N$219  (via drill 1)
  other vias: 85.09,38.1
N$220  (via drill 1)
  other vias: 87.63,38.1
N$221  (via drill 1)
  other vias: 90.17,38.1
N$222  (via drill 1)
  other vias: 57.15,40.64
N$223  (via drill 1)
  other vias: 59.69,40.64
N$224  (via drill 1)
  other vias: 62.23,40.64
N$225  (via drill 1)
  other vias: 64.77,40.64
N$226  (via drill 1)
  other vias: 67.31,40.64
N$227  (via drill 1)
  other vias: 69.85,40.64
N$228  (via drill 1)
  other vias: 72.39,40.64
N$229  (via drill 1)
  other vias: 74.93,40.64
N$230  (via drill 1)
  other vias: 77.47,40.64
N$231  (via drill 1)
  other vias: 80.01,40.64
N$232  (via drill 1)
  other vias: 82.55,40.64
N$233  (via drill 1)
  other vias: 85.09,40.64
N$234  (via drill 1)
  other vias: 87.63,40.64
N$235  (via drill 1)
  other vias: 90.17,40.64
N$242  (via drill 1)
  other vias: 57.15,43.18
N$243  (via drill 1)
  other vias: 59.69,43.18
N$244  (via drill 1)
  other vias: 62.23,43.18
N$245  (via drill 1)
  other vias: 64.77,43.18
N$246  (via drill 1)
  other vias: 67.31,43.18
N$247  (via drill 1)
  other vias: 69.85,43.18
N$248  (via drill 1)
  other vias: 72.39,43.18
N$249  (via drill 1)
  other vias: 74.93,43.18
N$250  (via drill 1)
  other vias: 77.47,43.18
N$251  (via drill 1)
  other vias: 80.01,43.18
N$252  (via drill 1)
  other vias: 82.55,43.18
N$253  (via drill 1)
  other vias: 85.09,43.18
N$254  (via drill 1)
  other vias: 87.63,43.18
N$255  (via drill 1)
  other vias: 90.17,43.18
N$256  (via drill 1)
  other vias: 57.15,45.72
N$257  (via drill 1)
  other vias: 59.69,45.72
N$258  (via drill 1)
  other vias: 62.23,45.72
N$259  (via drill 1)
  other vias: 64.77,45.72
N$260  (via drill 1)
  other vias: 67.31,45.72
N$261  (via drill 1)
  other vias: 69.85,45.72
N$262  (via drill 1)
  other vias: 72.39,45.72
N$263  (via drill 1)
  other vias: 74.93,45.72
N$264  (via drill 1)
  other vias: 77.47,45.72
N$265  (via drill 1)
  other vias: 80.01,45.72
N$266  (via drill 1)
  other vias: 82.55,45.72
N$267  (via drill 1)
  other vias: 85.09,45.72
N$268  (via drill 1)
  other vias: 87.63,45.72
N$269  (via drill 1)
  other vias: 90.17,45.72
N$270  (via drill 1)
  other vias: 57.15,48.26
N$271  (via drill 1)
  other vias: 59.69,48.26
N$272  (via drill 1)
  other vias: 62.23,48.26
N$273  (via drill 1)
  other vias: 64.77,48.26
N$274  (via drill 1)
  other vias: 67.31,48.26
N$275  (via drill 1)
  other vias: 69.85,48.26
N$276  (via drill 1)
  other vias: 72.39,48.26
N$277  (via drill 1)
  other vias: 74.93,48.26
N$278  (via drill 1)
  other vias: 77.47,48.26
N$279  (via drill 1)
  other vias: 80.01,48.26
N$280  (via drill 1)
  other vias: 82.55,48.26
N$281  (via drill 1)
  other vias: 85.09,48.26
N$282  (via drill 1)
  other vias: 87.63,48.26
N$283  (via drill 1)
  other vias: 90.17,48.26
N$290  (via drill 1)
  other vias: 57.15,50.8
N$291  (via drill 1)
  other vias: 59.69,50.8
N$292  (via drill 1)
  other vias: 62.23,50.8
N$293  (via drill 1)
  other vias: 64.77,50.8
N$294  (via drill 1)
  other vias: 67.31,50.8
N$295  (via drill 1)
  other vias: 69.85,50.8
N$296  (via drill 1)
  other vias: 72.39,50.8
N$297  (via drill 1)
  other vias: 74.93,50.8
N$298  (via drill 1)
  other vias: 77.47,50.8
N$299  (via drill 1)
  other vias: 80.01,50.8
N$300  (via drill 1)
  other vias: 82.55,50.8
N$301  (via drill 1)
  other vias: 85.09,50.8
N$302  (via drill 1)
  other vias: 87.63,50.8
N$303  (via drill 1)
  other vias: 90.17,50.8
N$304  (via drill 1)
  other vias: 57.15,53.34
N$305  (via drill 1)
  other vias: 59.69,53.34
N$306  (via drill 1)
  other vias: 62.23,53.34
N$307  (via drill 1)
  other vias: 64.77,53.34
N$308  (via drill 1)
  other vias: 67.31,53.34
N$309  (via drill 1)
  other vias: 69.85,53.34
N$310  (via drill 1)
  other vias: 72.39,53.34
N$311  (via drill 1)
  other vias: 74.93,53.34
N$312  (via drill 1)
  other vias: 77.47,53.34
N$313  (via drill 1)
  other vias: 80.01,53.34
N$314  (via drill 1)
  other vias: 82.55,53.34
N$315  (via drill 1)
  other vias: 85.09,53.34
N$316  (via drill 1)
  other vias: 87.63,53.34
N$317  (via drill 1)
  other vias: 90.17,53.34
N$318  (via drill 1)
  other vias: 57.15,55.88
N$319  (via drill 1)
  other vias: 59.69,55.88
N$320  (via drill 1)
  other vias: 62.23,55.88
N$321  (via drill 1)
  other vias: 64.77,55.88
N$322  (via drill 1)
  other vias: 67.31,55.88
N$323  (via drill 1)
  other vias: 69.85,55.88
N$324  (via drill 1)
  other vias: 72.39,55.88
N$325  (via drill 1)
  other vias: 74.93,55.88
N$326  (via drill 1)
  other vias: 77.47,55.88
N$327  (via drill 1)
  other vias: 80.01,55.88
N$328  (via drill 1)
  other vias: 82.55,55.88
N$329  (via drill 1)
  other vias: 85.09,55.88
N$330  (via drill 1)
  other vias: 87.63,55.88
N$331  (via drill 1)
  other vias: 90.17,55.88
N$338  (via drill 1)
  other vias: 57.15,58.42
N$339  (via drill 1)
  other vias: 59.69,58.42
N$340  (via drill 1)
  other vias: 62.23,58.42
N$341  (via drill 1)
  other vias: 64.77,58.42
N$342  (via drill 1)
  other vias: 67.31,58.42
N$343  (via drill 1)
  other vias: 69.85,58.42
N$344  (via drill 1)
  other vias: 72.39,58.42
N$345  (via drill 1)
  other vias: 74.93,58.42
N$346  (via drill 1)
  other vias: 77.47,58.42
N$347  (via drill 1)
  other vias: 80.01,58.42
N$348  (via drill 1)
  other vias: 82.55,58.42
N$349  (via drill 1)
  other vias: 85.09,58.42
N$350  (via drill 1)
  other vias: 87.63,58.42
N$351  (via drill 1)
  other vias: 90.17,58.42
N$352  (via drill 1)
  other vias: 57.15,60.96
N$353  (via drill 1)
  other vias: 59.69,60.96
N$354  (via drill 1)
  other vias: 62.23,60.96
N$355  (via drill 1)
  other vias: 64.77,60.96
N$356  (via drill 1)
  other vias: 67.31,60.96
N$362  (via drill 1)
  other vias: 82.55,60.96
N$366  (via drill 0.5)
  Top 0.406: IC4.13 79.38,74.3 76.83,76.83 74.93,76.83 74.3,77.47 v73.66,77.47
  Bottom 0.406: v73.66,77.47 53.34,77.47 50.8,74.93 38.1,74.93 36.83,73.66 22.86,73.66 21.59,72.39 7.62,72.39 5.43,70.2 K4.A2
N$367  (via drill 0.5)
  Top 0.406: IC4.14 78.11,74.3 76.52,75.88 73.98,75.88 v73.66,76.2
  Bottom 0.406: v73.66,76.2 54.61,76.2 52.07,73.66 39.37,73.66 38.1,72.39 24.13,72.39 21.94,70.2 K3.A2
N$368  (via drill 0.5)
  Top 0.406: IC4.15 76.83,74.3 76.2,74.93 v73.66,74.93
  Bottom 0.406: v73.66,74.93 55.88,74.93 53.34,72.39 40.64,72.39 38.45,70.2 K2.A2
N$369  (via drill 0.5)
  Top 0.406: IC4.16 74.4,72.92 v73.66,73.66
  Bottom 0.406: v73.66,73.66 57.15,73.66 54.96,71.47 K1.A2
N$392  (via drill 1)
  other vias: 54.61,35.56
N$423  (via drill 1)
  other vias: 52.07,60.96
N$424  (via drill 1)
  other vias: 54.61,55.88
N$425  (via drill 1)
  other vias: 54.61,58.42
N$426  (via drill 1)
  other vias: 54.61,60.96
N$441  (via drill 1)
  other vias: 16.51,60.96
N$442  (via drill 1)
  other vias: 19.05,60.96
N$443  (via drill 1)
  other vias: 21.59,60.96
N$444  (via drill 1)
  other vias: 24.13,60.96
N$445  (via drill 1)
  other vias: 26.67,60.96
N$446  (via drill 1)
  other vias: 29.21,60.96
N$447  (via drill 1)
  other vias: 31.75,60.96
N$448  (via drill 1)
  other vias: 34.29,60.96
N$449  (via drill 1)
  other vias: 36.83,60.96
N$450  (via drill 1)
  other vias: 39.37,60.96
N$451  (via drill 1)
  other vias: 41.91,60.96
N$452  (via drill 1)
  other vias: 44.45,60.96
N$453  (via drill 1)
  other vias: 46.99,60.96
N$454  (via drill 1)
  other vias: 49.53,60.96
N$470  (via drill 1)
  other vias: 3.81,60.96
N$471  (via drill 1)
  other vias: 6.35,60.96
N$472  (via drill 1)
  other vias: 8.89,60.96
N$473  (via drill 1)
  other vias: 11.43,60.96
N$474  (via drill 1)
  other vias: 13.97,60.96
N$476  (via drill 1)
  other vias: 54.61,33.02
N$479  (via drill 1)
  other vias: 57.15,63.5
N$480  (via drill 1)
  other vias: 59.69,63.5
N$481  (via drill 1)
  other vias: 62.23,63.5
N$482  (via drill 1)
  other vias: 64.77,63.5
N$483  (via drill 1)
  other vias: 67.31,63.5
N$493  (via drill 1)
  other vias: 52.07,63.5
N$494  (via drill 1)
  other vias: 54.61,63.5
N$495  (via drill 1)
  other vias: 16.51,63.5
N$496  (via drill 1)
  other vias: 19.05,63.5
N$497  (via drill 1)
  other vias: 21.59,63.5
N$498  (via drill 1)
  other vias: 24.13,63.5
N$499  (via drill 1)
  other vias: 26.67,63.5
N$500  (via drill 1)
  other vias: 29.21,63.5
N$501  (via drill 1)
  other vias: 31.75,63.5
N$502  (via drill 1)
  other vias: 34.29,63.5
N$503  (via drill 1)
  other vias: 36.83,63.5
N$504  (via drill 1)
  other vias: 39.37,63.5
N$505  (via drill 1)
  other vias: 41.91,63.5
N$506  (via drill 1)
  other vias: 44.45,63.5
N$507  (via drill 1)
  other vias: 46.99,63.5
N$508  (via drill 1)
  other vias: 49.53,63.5
N$509  (via drill 1)
  other vias: 3.81,63.5
N$510  (via drill 1)
  other vias: 6.35,63.5
N$511  (via drill 1)
  other vias: 8.89,63.5
N$512  (via drill 1)
  other vias: 11.43,63.5
N$513  (via drill 1)
  other vias: 13.97,63.5
OSC_IN  (via drill 0.4)
  Top 0.2: v31.4,10.8 30.8,11.4 arc-23 30.4,12 arc36 IC1.5 | v38.3,10.1 v41.5,10.1 | C2.1 47.06,8.9 arc-90 R5.1 Q1.1
  Bottom 0.2: v31.4,10.8 36.4,10.8 arc-40 v38.3,10.1 | Q1.1 R5.1 45.34,10.1 v41.5,10.1
OSC_OUT  (via drill 0.4)
  Top 0.2: v37.6,9.4 39.9,9.4 arc-14 v41.5,9.2 | v30.6,10.4 arc53 30.3,11.3 arc-16 30,11.7 arc24 IC1.6 | C3.1 47.49,6.3 arc-50 Q1.2
  Bottom 0.2: Q1.2 R5.2 45.24,9.2 v41.5,9.2 | v30.6,10.4 arc53 31.4,10 arc44 31.9,10.2 arc-44 32.4,10.4 36.4,10.4 arc-80 v37.6,9.4
PA0  (via drill 0.4)
  Top 0.2: IC1.10 27.55,11.4 23.2,11.4 arc-23 22.7,11.5 arc23 22.2,11.6 20,11.6 arc-44 19,12 arc50 v18.4,12.2
  Bottom 0.2: J1.40 arc8 6,15.5 arc21 18.2,13.4 arc-162 v18.4,12.2
PA1  (via drill 0.4)
  Top 0.2: IC1.11 27.25,11 23,11 arc-23 22.5,11.1 arc23 22,11.2 19.7,11.2 arc-11 v18.7,11.3
  Bottom 0.2: J1.39 arc11 8.5,15.5 arc19 18.4,13.8 arc-90 19.2,13 arc-33 v18.7,11.3
PA2  (via drill 0.4)
  Top 0.2: IC1.12 26.94,10.6 22.8,10.6 arc-23 22.3,10.7 arc23 21.8,10.8 19.8,10.8 arc40 v18.7,10.4
  Bottom 0.2: J1.38 arc9 11.1,15.5 arc20 18.4,14.2 arc-90 19.6,13 arc-13 19.4,11.2 arc-57 v18.7,10.4
PA3  (via drill 0.4)
  Top 0.2: v19.6,10.1 20.7,10.1 arc-57 21.2,9.8 arc59 21.9,9.4 25.2,9.4 arc-64 IC1.13
  Bottom 0.2: v19.6,10.1 arc16 20,13 arc90 18.4,14.6 arc-21 13.6,15.5 arc-7 J1.37
PA4  (via drill 0.4)
  Top 0.2: v20.1,9.3 20.7,9.3 arc-28 21.1,9.2 arc28 21.9,9 25.2,9 arc-90 26.4,7.8 arc90 27,7.2 arc65 IC1.14
  Bottom 0.2: v20.1,9.3 arc9 20.4,13 arc90 18.4,15 arc-27 15.9,15.6 arc3 J1.36
PA5  (via drill 0.4)
  Top 0.2: v20.4,8.4 arc-16 21.8,8.6 25.2,8.6 arc-90 26,7.8 arc90 27,6.8 27.38,6.8 arc50 27.8,7 arc-6 IC1.15
  Bottom 0.2: v20.4,8.4 arc44 20.8,9.4 20.8,13 arc90 18.4,15.4 arc-61 J1.35
PA6  (via drill 0.4)
  Top 0.2: v21.9,7.9 22.2,8.2 25.2,8.2 arc-90 25.6,7.8 arc90 27,6.4 27.48,6.4 arc61 IC1.16
  Bottom 0.2: J1.34 arc-66 21.2,13.2 21.2,10.2 arc34 v21.9,7.9
PA7  (via drill 0.4)
  Top 0.2: IC1.17 29.4,7.21 arc90 29.4,7.6 28.4,8.6 arc41 24.4,10.1 v21.9,10.1
  Bottom 0.2: J1.33 21.59,11.21 arc31 v21.9,10.1
PA8
  Top 0.2: IC1.29 35.57,4.8 41.4,4.8 arc90 44.2,7.6 44.2,14.4 arc-90 44.8,15 arc24 47.6,15.6 arc2 J1.22
PA9/TXD1
  Top 0.2: IC1.30 35.88,5.2 41.4,5.2 arc90 43.8,7.6 43.8,14.6 arc-82 44.5,15.4 arc33 J1.23
PA10/RXD1
  Top 0.2: IC1.31 36.18,5.6 41.4,5.6 arc90 43.4,7.6 43.4,14.6 arc-58 J1.24
PA11/USBDM
  Top 0.2: IC1.32 36.49,6 41.4,6 arc90 43,7.6 43,14.6 arc59 J1.25
PA12/USBDP
  Top 0.2: IC1.33 36.8,6.4 41.4,6.4 arc90 42.6,7.6 42.6,14.6 arc90 41.8,15.4 arc-49 J1.26
PA13/SWDIO  (via drill 0.4)
  Top 0.2: IC1.34 37.1,6.8 40.2,6.8 arc30 v41.7,7.2 arc42 42.2,8.5 42.2,14.4 arc90 41.6,15 arc-22 39,15.5 arc-6 J1.27
  Bottom 0.2: v41.7,7.2 arc-5 43.2,7.2 arc-57 44.2,6.6 arc59 45.6,5.8 arc90 47,7.2 47,8 arc-90 47.6,8.6 R8.1
PA14/SWCLK  (via drill 0.4)
  Top 0.2: IC1.37 38.14,11 arc-42 39.5,11.6 arc25 v40.6,11.9 40.6,12.7 arc90 39.5,13.8 arc33 38.5,13.5 arc-123 37.2,14.2 arc90 36,15.4 arc-66 J1.28
  Bottom 0.2: v40.6,11.9 arc-4 43.6,12 arc62 44.6,12.6 arc-62 45.6,13.2 48.4,13.2 arc-90 49.3,12.3 49.3,10.5 arc90 50,9.8 50.8,9.8 arc-90 51.2,9.4 51.2,7.76 arc-90 R7.1
PA15
  Top 0.2: IC1.38 37.8,11.37 arc-49 39.5,12 arc90 40.2,12.7 arc90 39.5,13.4 arc32 38.8,13.2 arc-64 37.2,13.2 arc-63 36.8,14 arc90 35.8,15 arc-35 33.6,15.7 arc23 J1.29
PB0
  Top 0.2: IC1.18 27.25,4.35 arc-49 25.6,3.6 10.8,3.6 arc31 5.8,2.2 arc-12 J1.1
PB1
  Top 0.2: IC1.19 27.55,3.95 arc-42 25.6,3.2 10.8,3.2 arc48 8.1,2 arc-51 J1.2
PB2  (1 unrouted)
  Top 0.2: IC1.20 28.2,3.9 arc-46 25.6,2.8 10.8,2.8 arc77 J1.3
  Bottom 0.2: R15.1 8.8,3.4 | 8.8,3.4 8.8,1.36 J1.3 | 10.6,3.8 9.2,3.8 8.8,3.4
PB3/SWO  (via drill 0.4)
  Top 0.2: v35,9 arc-29 35.4,9.68 IC1.39 37.42,11.7 arc-39 v39.5,12.7
  Bottom 0.2: v35,9 arc56 31.2,8.3 arc0 30.7,7.9 arc-41 29.8,7.6 26.4,7.6 arc51 23.9,6.4 arc-39 21.5,4.9 arc11 20.9,4.7 arc-25 18,4.1 arc36 14.4,3 arc-9 J1.4 | v39.5,12.7 arc-4 43.4,12.4 arc66 44.2,12.8 arc-59 45.6,13.6 48.5,13.6 arc-90 49.7,12.4 49.7,11.54 arc90 R9.1
PB4  (via drill 0.4)
  Top 0.2: IC1.40 34.7,9.68 arc55 v34.3,8.4
  Bottom 0.2: v34.3,8.4 arc58 30.8,7.4 arc-46 30.3,7.2 arc3 26.4,7.2 arc50 24.2,6.1 arc-41 19.6,3.8 arc-6 17.8,3.7 arc64 J1.5
PB5  (via drill 0.4)
  Top 0.2: IC1.41 34.4,10.09 arc51 v33.6,7.8
  Bottom 0.2: v33.6,7.8 arc62 31.2,7.2 arc-16 30.8,6.9 arc-29 30.4,6.8 arc1 26.6,6.8 arc41 24.8,6.1 arc1 24.3,5.6 arc-42 19,3.2 arc69 J1.6
PB6/SCL1  (via drill 0.4)
  Top 0.2: IC1.42 34.1,10.5 arc50 v32.9,7.2
  Bottom 0.2: v32.9,7.2 arc73 31.6,7 arc-19 30.9,6.5 arc-30 30.4,6.4 27,6.4 arc49 24.6,5.3 arc-17 23.2,4.1 arc-22 20.1,2.9 arc94 J1.7
PB7/SDA1  (via drill 0.4)
  Top 0.2: IC1.43 33.8,10.9 arc49 v32.2,6.6
  Bottom 0.2: v32.2,6.6 arc53 31.6,6.4 arc-46 30.6,6 arc3 27.2,6 arc44 24.9,5 arc-1 24.5,4.6 arc-23 22.2,3.1 arc99 J1.8
PB8/CANRX  (via drill 0.4)
  Top 0.2: v18,4.8 R11.1 | v36.1,13.8 arc41 34.78,13.3 IC1.45 34,12.52 arc38 33.7,11.9 arc-40 33.3,11.1 32.2,10 arc-10 v30.9,8.9
  Bottom 0.2: v30.9,8.9 arc-28 30.6,8.4 arc-54 29.8,8 arc1 29.1,8 arc-1 26.4,8 arc31 24.2,7.4 arc28 23.8,7 arc-18 23.3,6.4 arc-22 21.4,5.3 arc-19 18.4,4.8 v18,4.8 | J1.14 arc13 38.8,2.2 arc58 39.8,4 39.8,10.1 arc45 39.3,11.3 arc28 38.8,11.6 arc-78 38.4,12.2 arc90 36.9,13.7 36.8,13.7 arc-13 v36.1,13.8
PB9/CANTX  (via drill 0.4)
  Top 0.2: v16.4,5.8 16,6.2 14.77,6.2 IC2.1 | v34.9,14.2 34.77,14 IC1.46 33.6,12.82 arc39 33.3,12.2 arc-35 32.9,11.3 32,10.4 arc-28 31,9.8 arc46 30.4,9.3 arc-13 v30,8.7
  Bottom 0.2: J1.15 arc34 40.2,4 40.2,10.1 arc58 39.2,11.9 arc-53 38.8,12.6 arc30 38.6,13.2 arc58 36.1,14.5 arc25 v34.9,14.2 | v16.4,5.8 17,5.8 arc-14 18.6,5.6 arc51 22.6,6.4 arc16 23.4,7.2 arc-53 25.8,8.4 28.4,8.4 arc21 v30,8.7
PB10
  Top 0.2: IC1.21 29.8,4.78 arc76 30,3.2 arc46 32,2.4 39.4,2.4 arc-48 J1.16
PB11
  Top 0.2: IC1.22 30.2,4.47 arc90 30.2,3.6 arc46 32.2,2.8 39.4,2.8 arc-34 J1.17
PB12
  Top 0.2: IC1.25 34.34,3.2 39.4,3.2 arc-29 J1.18
PB13
  Top 0.2: IC1.26 34.65,3.6 39.4,3.6 arc-20 47.5,2.2 arc-10 J1.19
PB14
  Top 0.2: IC1.27 34.95,4 39.4,4 arc-19 50.1,2.2 arc-12 J1.20
PB15
  Top 0.2: IC1.28 35.26,4.4 41.4,4.4 arc90 44.6,7.6 44.6,14 arc-90 45.2,14.6 arc23 50.1,15.6 arc3 J1.21
PC13
  Top 0.2: R3.2 24.8,14.8 25,15 29,15 arc-40 29.96,14.66 IC1.2
PC14/OSC32_IN  (via drill 0.4)
  Top 0.2: IC1.3 30.91,13 arc22 31.2,12.8 arc10 v31.7,12.8
  Bottom 0.2: J1.13 arc-29 36.6,2.3 arc-10 37.8,2.4 arc90 39.4,4 39.4,10.1 arc72 38.6,11.2 arc-70 38,12 38,12.2 arc90 36.9,13.3 arc40 35.8,12.9 arc-27 35.4,12.7 arc-29 v31.7,12.8
PC15/OSC32_OUT  (via drill 0.4)
  Top 0.2: IC1.4 v31,12.2
  Bottom 0.2: J1.12 arc-19 34,2.3 arc-15 37.8,2.8 arc90 39,4 39,10.1 arc81 38.4,10.8 arc-85 37.6,11.8 37.6,12.2 arc90 36.9,12.9 arc41 36.1,12.6 arc-29 35.5,12.3 arc-21 v31,12.2
S2.3V3  (via drill 1)  (39 unrouted)
  Top 0.406: MOD1.10 3V3.1 | v26.67,35.56 3V3.1 | 3V3.1 25.4,31.75 25.4,26.67 v26.67,25.4
  Top 0.61: v29.21,25.4 v87.63,25.4 v90.17,25.4 v92.71,27.94 v92.71,30.48 v92.71,63.5 92.71,69.22 C28.+ 92.08,74.68 C26.1 86.68,75.56 86.04,76.2 86.04,79.38 86.68,80.01 U2.2 | v8.89,25.4 v24.13,25.4 v26.67,25.4
  Bottom 0.61: v8.89,25.4 v87.63,25.4 v90.17,25.4 v92.71,27.94 v92.71,30.48 v92.71,63.5
  other vias: 11.43,25.4 13.97,25.4 16.51,25.4 19.05,25.4 21.59,25.4 31.75,25.4 34.29,25.4 36.83,25.4 39.37,25.4 41.91,25.4 44.45,25.4 46.99,25.4 49.53,25.4 52.07,25.4 54.61,25.4 57.15,25.4 59.69,25.4 62.23,25.4 64.77,25.4 67.31,25.4 69.85,25.4 72.39,25.4 74.93,25.4 77.47,25.4 80.01,25.4 82.55,25.4 85.09,25.4 92.71,33.02 92.71,35.56 92.71,38.1 92.71,40.64 92.71,45.72 92.71,43.18 92.71,48.26 92.71,50.8 92.71,53.34 92.71,55.88 92.71,58.42 92.71,60.96
S2.AVCC  (via drill 1)  (1 unrouted)
  Top 0.406: MOD1.30 AVCC.1
  other vias: 29.21,55.88
S2.IN1
  Top 0.254: IN1.1 72.39,66.04 74.83,66.04 IC4.1
S2.IN2
  Top 0.254: IC4.2 76.83,65.72 75.88,64.77 73.66,64.77 IN2.1
S2.IN3
  Top 0.254: IC4.3 78.11,65.41 77.47,64.77 76.83,64.77 75.56,63.5 IN3.1
S2.IN4
  Top 0.254: IN4.1 79.38,65.41 IC4.4
S2.IN5
  Top 0.254: IC4.5 80.64,64.14 IN5.1
S2.IN6
  Top 0.254: IC4.6 81.92,64.77 81.28,64.14 81.28,62.23 IN6.1
S2.IN7
  Top 0.254: IC4.7 83.19,64.14 IN7.1
S2.OSC32_IN  (via drill 1)  (1 unrouted)
  Top 0.406: PC14.1 MOD1.13 R36.2 36.58,42.16 Q3.2 38.1,43.18 38.1,45.72 37.21,46.61 C24.1
  other vias: 34.29,35.56
S2.OSC32_OUT  (via drill 1)  (1 unrouted)
  Top 0.406: R36.1 C23.1 | PC15.1 MOD1.12 31.75,43.18 32.77,44.2 R36.1 | R36.1 36.58,44.2 Q3.1
  other vias: 31.75,35.56
S2.OUT5
  Top 0.254: IC4.12 80.64,72.39 arc90 83.82,69.22 arc-90 85.72,67.31 85.72,64.77 arc-53 OUT5.1
S2.OUT6
  Top 0.254: IC4.11 81.92,71.75 arc90 83.82,69.85 arc-90 86.36,67.31 86.36,64.77 arc90 OUT6.1
S2.OUT7
  Top 0.254: IC4.10 83.19,71.12 arc90 83.82,70.48 arc-90 87,67.31 87,66.04 arc90 88.27,64.77 arc-67 OUT7.1
S2.PA0  (via drill 1)  (1 unrouted)
  Top 0.406: MOD1.40 PA0.1
  other vias: 3.81,55.88
S2.PA1  (via drill 1)  (1 unrouted)
  Top 0.406: MOD1.39 PA1.1
  other vias: 6.35,55.88
S2.PA2  (via drill 1)  (1 unrouted)
  Top 0.406: MOD1.38 PA2.1
  other vias: 8.89,55.88
S2.PA3  (via drill 1)  (1 unrouted)
  Top 0.406: MOD1.37 PA3.1
  other vias: 11.43,55.88
S2.PA4  (via drill 1)  (1 unrouted)
  Top 0.406: MOD1.36 PA4.1
  other vias: 13.97,55.88
S2.PA5  (via drill 1)  (1 unrouted)
  Top 0.406: MOD1.35 PA5.1
  other vias: 16.51,55.88
S2.PA6  (via drill 1)  (1 unrouted)
  Top 0.406: MOD1.34 PA6.1
  other vias: 19.05,55.88
S2.PA7  (via drill 1)  (1 unrouted)
  Top 0.406: MOD1.33 PA7.1
  other vias: 21.59,55.88
S2.PA8  (via drill 1)  (1 unrouted)
  Top 0.406: MOD1.22 PA8.1
  other vias: 49.53,55.88
S2.PA9  (via drill 1)  (1 unrouted)
  Top 0.406: MOD1.23 PA9.1
  other vias: 46.99,55.88
S2.PA10  (via drill 1)  (1 unrouted)
  Top 0.406: MOD1.24 PA10.1
  other vias: 44.45,55.88
S2.PA11  (via drill 1)  (1 unrouted)
  Top 0.406: MOD1.25 PA11.1
  other vias: 41.91,55.88
S2.PA12  (via drill 1)  (1 unrouted)
  Top 0.406: MOD1.26 PA12.1
  other vias: 39.37,55.88
S2.PA13  (via drill 1)  (1 unrouted)
  Top 0.406: MOD1.27 PA13.1
  other vias: 36.83,55.88
S2.PA14  (via drill 1)  (1 unrouted)
  Top 0.406: MOD1.28 PA14.1
  other vias: 34.29,55.88
S2.PA15  (via drill 1)  (1 unrouted)
  Top 0.406: MOD1.29 PA15.1
  other vias: 31.75,55.88
S2.PB0  (via drill 1)  (1 unrouted)
  Top 0.406: MOD1.1 PB0.1
  other vias: 3.81,35.56
S2.PB1  (via drill 1)  (1 unrouted)
  Top 0.406: MOD1.2 PB1.1
  other vias: 6.35,35.56
S2.PB2  (via drill 1)  (1 unrouted)
  Top 0.406: MOD1.3 PB2.1
  other vias: 8.89,35.56
S2.PB3  (via drill 1)  (1 unrouted)
  Top 0.406: MOD1.4 PB3.1
  other vias: 11.43,35.56
S2.PB4  (via drill 1)  (1 unrouted)
  Top 0.406: MOD1.5 PB4.1
  other vias: 13.97,35.56
S2.PB5  (via drill 1)  (1 unrouted)
  Top 0.406: MOD1.6 PB5.1
  other vias: 16.51,35.56
S2.PB6  (via drill 1)  (1 unrouted)
  Top 0.406: MOD1.7 PB6.1
  other vias: 19.05,35.56
S2.PB7  (via drill 1)  (1 unrouted)
  Top 0.406: MOD1.8 PB7.1
  other vias: 21.59,35.56
S2.PB8  (via drill 1)  (1 unrouted)
  Top 0.406: MOD1.14 PB8.1
  other vias: 36.83,35.56
S2.PB9  (via drill 1)  (1 unrouted)
  Top 0.406: MOD1.15 PB9.1
  other vias: 39.37,35.56
S2.PB10  (via drill 1)  (1 unrouted)
  Top 0.406: MOD1.16 PB10.1
  other vias: 41.91,35.56
S2.PB11  (via drill 1)  (1 unrouted)
  Top 0.406: MOD1.17 PB11.1
  other vias: 44.45,35.56
S2.PB12  (via drill 1)  (1 unrouted)
  Top 0.254: v69.85,60.96 69.22,60.96 67.94,59.69 53.98,59.69 53.34,59.05 53.34,52.07 arc-37 52.7,50.16 arc37 52.07,48.26 52.07,43.18 arc-80 48.9,39.37 arc47 MOD1.18
  Top 0.406: MOD1.18 PB12.1
  other vias: 46.99,35.56
S2.PB13  (via drill 1)  (1 unrouted)
  Top 0.254: v72.39,60.96 71.75,60.96 70.48,59.69 69.22,59.69 68.58,59.05 68.58,57.78 67.94,57.15 56.52,57.15 55.88,56.52 55.88,55.24 53.98,53.34 53.98,51.44 arc-37 53.34,49.53 arc37 52.7,47.62 52.7,43.18 arc-64 MOD1.19
  Top 0.406: MOD1.19 PB13.1
  other vias: 49.53,35.56
S2.PB14  (via drill 1)  (1 unrouted)
  Top 0.254: v74.93,60.96 74.3,60.96 73.03,59.69 71.75,59.69 71.12,59.05 71.12,57.78 70.48,57.15 69.22,57.15 68.58,56.52 68.58,55.24 67.94,54.61 56.52,54.61 54.61,52.7 54.61,50.8 arc-37 53.98,48.9 arc37 53.34,46.99 53.34,43.18 arc-28 MOD1.20
  Top 0.406: MOD1.20 PB14.1
  other vias: 52.07,35.56
S2.PB15  (via drill 1)  (1 unrouted)
  Top 0.254: v77.47,60.96 76.2,62.23 53.98,62.23 53.34,61.59 53.34,60.33 52.07,59.05 PB15.1
  Top 0.406: MOD1.21 PB15.1
  other vias: 52.07,55.88
S2.VBAT  (via drill 1)  (1 unrouted)
  Top 0.406: G1.+ 24.13,46.35 MOD1.32 VBAT.1
  other vias: 24.13,55.88
S3.AIN1
  Top 0.2: IC3.10 73.65,6.05 arc90 73.2,5.6 73.2,4.2 arc42 R29.1 73.66,2.1 | R30.2 73.66,2.1 | 66.04,2.1 65.21,2.1 64.77,2.54 R38.1 | 66.04,2.1 73.66,2.1 | C29.1 66.07,2.07 66.04,2.1
S3.LED  (via drill 0.4)
  Top 0.2: IC3.30 83.75,7.55 v84,7.8 | 87.4,14.76 R35.1 | R34.1 R35.1 | v86.3,14.8 R35.1
  Bottom 0.2: v84,7.8 arc39 85,10.6 85,11.8 arc-47 v86.3,14.8
S3.OSC_IN
  Top 0.2: 69.81,11.4 Q2.1 | C11.1 67.05,12.96 arc-59 Q2.1 | Q2.1 arc-37 71.79,10.41 73.45,8.75 arc65 IC3.5
S3.OSC_OUT
  Top 0.2: C12.1 66.95,8.24 arc-60 Q2.2 69.8,9 arc-90 71,10.2 arc-46 71.7,9.9 73.15,8.45 arc53 IC3.6
S3.SWCLK
  Top 0.2: IC3.37 81.35,14.05 arc90 80.4,15 79.2,15 arc-53 JP1.2
S3.SWDIO
  Top 0.2: IC3.34 82.25,9.55 arc-90 81.6,10.2 81.6,10.6 arc-23 81.7,11.1 arc23 81.8,11.6 81.8,14 arc33 JP1.4
S3.SWIM  (via drill 0.4)
  Top 0.2: IC3.22 80.35,4.65 arc50 80,5.4 arc-47 79.6,6.2 79.6,9.4 arc32 v79.2,10.8 | IC3.45 77.35,11.45 arc42 v77.6,10.8
  Bottom 0.2: v79.2,10.8 v77.6,10.8
S3.SWIM_IN
  Top 0.2: IC3.21 79.85,4.55 arc49 79.6,5.1 arc-50 79.2,6 79.2,9.4 arc90 78.4,10.2 | IC3.43 78.35,10.65 arc13 78.4,10.2 | IC3.46 76.85,11.35 arc-1 76.9,10.7 arc105 77.8,10.1 arc-19 78.4,10.2
S3.SWIM_RST
  Top 0.2: IC3.42 78.85,13.73 R37.2
S3.SWIM_RST_IN
  Top 0.2: IC3.41 79.35,12.99 80.17,13.81 R37.1
S3.T_JTCK  (via drill 0.4)
  Top 0.2: IC3.26 82.05,5.55 arc-55 v80.8,6.2 | R22.1 v65.2,7.4 | IC3.15 76.85,4.25 arc-69 v77.3,4.9
  Bottom 0.2: 77.8,6.6 79.8,6.6 arc-44 v80.8,6.2 | 77.8,6.6 77.8,6 arc-49 v77.3,4.9 | v65.2,7.4 arc-7 68.6,7.6 76,7.6 arc-53 77.2,7 arc39 77.8,6.6
S3.T_JTMS  (via drill 0.4)
  Top 0.2: R23.1 v65.2,10 | v81.4,7 81.4,6.8 arc90 82.15,6.05 IC3.27 84.85,6.05 R19.1
  Bottom 0.2: v81.4,7 78.9,7 arc-42 77.4,7.5 arc39 76,8 68.6,8 arc-61 v65.2,10
S3.T_NRST  (via drill 0.4)
  Top 0.2: v65.2,12.6 R25.1 | v78,8 78,5 arc44 78.2,4.5 arc-34 78.3,4.3 arc-11 IC3.18
  Bottom 0.2: v78,8 arc53 77.2,8.4 68.8,8.4 arc-74 65.6,10.8 arc-7 v65.2,12.6
S3.T_SWDIO_IN
  Top 0.2: IC3.25 84.33,5.05 R19.2
S3.T_SWO  (via drill 0.4)
  Top 0.2: R24.1 v65.2,15.2 | IC3.31 82.15,8.05 arc-60 v81.2,8.6
  Bottom 0.2: v81.2,8.6 81,8.8 69,8.8 arc-90 66,11.8 66,13.8 arc59 v65.2,15.2
S3.USBDM
  Top 0.2: IC3.32 85.31,8.55 arc-47 R27.1
S3.USBDP
  Top 0.2: IC3.33 86.81,9.05 R26.1
SWCLK
  Top 0.2: SWD2.2 59.5,5.4 arc-21 R22.2
  Top 0.406: SWD2.2 SWD1.2
  Bottom 0.2: R7.2 SWD1.2
SWDIO
  Top 0.2: R23.2 59.34,10 SWD2.4
  Top 0.406: SWD1.4 SWD2.4
  Bottom 0.2: R8.2 52.34,8.6 arc83 SWD1.4
SWO
  Top 0.2: R24.2 59.22,15.2 SWD2.6
  Top 0.406: SWD1.6 SWD2.6
  Bottom 0.2: R9.2 51.96,11.56 arc-60 SWD1.6
VBAT
  Top 0.2: J1.32 arc-76 25.6,16 arc57 26.7,15.4 29,15.4 arc-46 30.61,14.71 IC1.1
VCC  (via drill 0.4)
  Top 0.2: IC3.9 73.05,6.55 v72.8,6.6 | IC3.24 81.35,2.15 v81.2,2 arc-24 R20.2 | IC3.36 84.15,10.55 v84.2,10.6 | IC3.48 75.85,12.08 v74.85,12.45 | v72.8,6.6 v71,9.5 | v72.8,6.6 72.8,4.2 arc-58 R29.2 | v88.8,5.6 arc-28 89.2,4 arc37 89.8,2.2 arc53 91.4,1.4 R33.1 | v93.2,15.8 96.6,15.8 arc-94 LED4.A | IC3.1 74.35,11.95 v74.85,12.45 | v74.85,12.45 74.85,12.62 73.98,13.49 73.98,14.13 75.2,15.35 JP1.1
  Top 0.406: v84.2,10.6 84.4,10.8 R28.2 arc-91 89.2,13 v89.6,13
  Bottom 0.2: v81.2,2 C13.1 | C15.1 v74.85,12.45 v71,9.5 | v84.2,10.6 83.16,10.2 C14.1 | v88.8,5.6 U1.2 | C16.1 v72.8,6.6 | v93.2,15.8 91.8,14.4 C21.+
  Bottom 0.406: U1.2 88.8,9.84 C20.1 arc81 89.6,11.2 v89.6,13 C21.+ | C15.1 81.24,12.36 arc-100 C14.1 83.06,4.14 arc-90 82.16,3.24 C13.1

## Text on the board
tPlace: i@tuxotronic.org | Rst | Sys
bPlace: PA0 | PA1 | PA2 | PA3 | PA4 | PA5 | PA6 | PA7 | Vbat | GND | AVCC | PA15 | PA14 | PA13 | PA12 | PA11 | PA10 | PA9 | PA8 | PB15 | i@tuxotronic.org | L- | CAN | H+ | Rev.13A | CANARM | GND | i@tuxotronic.org | PB1 | PB2 | PB3 | PB4 | PB5 | PB6 | PB7 | !RST | +3V3 | GND | PC15 | PC14 | PB8 | PB9 | PB10 | PB11 | PB12 | PB13 | PB14 | PB0 | ST-Link/Versaloon